# Altium schematic sheet Sch5PowerControlCenter.SchDoc: Power Control Center (PCC)
size A3; Address1: Afshin Kashani Ilkhechi; DocumentNumber: 5; Revision: 2; SheetNumber: 5; SheetTotal: 5
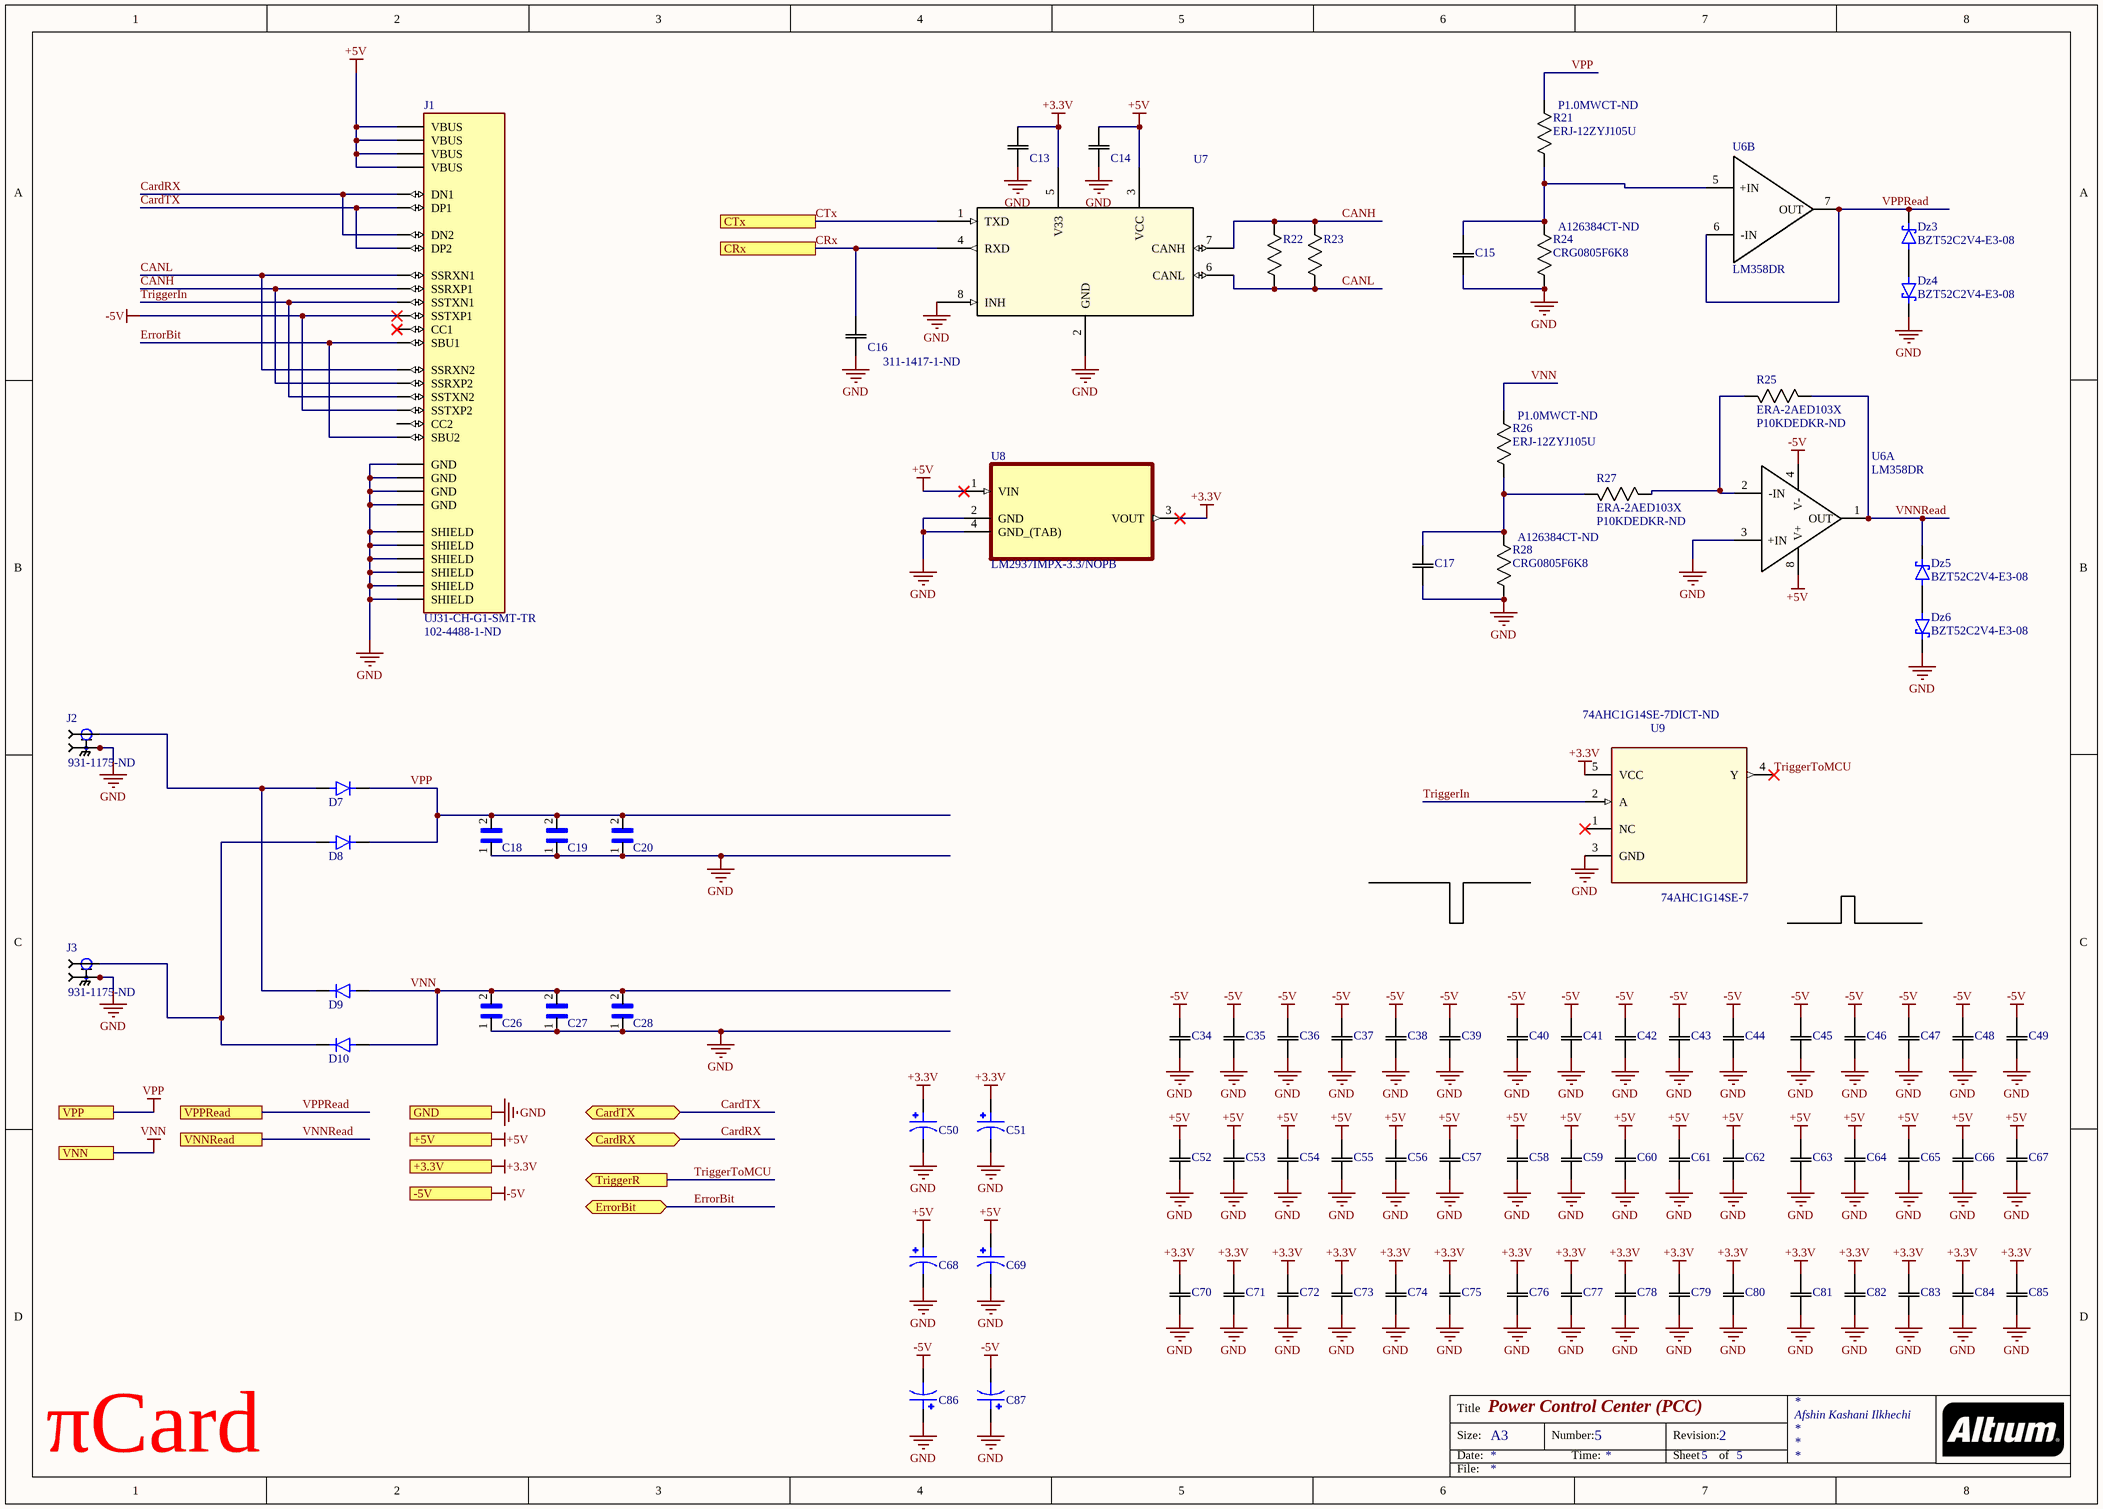
[diagram p0: Sch5PowerControlCenter.SchDoc]

## Parts
C13  GRM155R71C103MA01D  [C0402]  (value not drawn)
C14  GRM155R71C103MA01D  [C0402]  (value not drawn)
C15  C0805C104Z5VACTU  [C0805]  (value not drawn)
C16  Supplier Part Number 1: 311-1417-1-ND  [C0402]  (hidden comment: CC0402JRNPO9BN200)
C17  C0805C104Z5VACTU  [C0805]  (value not drawn)
C18  2220Y5000105KXTWS2  [CAPC5750X450N]  (value not drawn)
C19  2220Y5000105KXTWS2  [CAPC5750X450N]  (value not drawn)
C20  2220Y5000105KXTWS2  [CAPC5750X450N]  (value not drawn)
C26  2220Y5000105KXTWS2  [CAPC5750X450N]  (value not drawn)
C27  2220Y5000105KXTWS2  [CAPC5750X450N]  (value not drawn)
C28  2220Y5000105KXTWS2  [CAPC5750X450N]  (value not drawn)
C34  GRM155R71C103MA01D  [C0402]  (value not drawn)
C35  GRM155R71C103MA01D  [C0402]  (value not drawn)
C36  GRM155R71C103MA01D  [C0402]  (value not drawn)
C37  GRM155R71C103MA01D  [C0402]  (value not drawn)
C38  GRM155R71C103MA01D  [C0402]  (value not drawn)
C39  GRM155R71C103MA01D  [C0402]  (value not drawn)
C40  C0805C104Z5VACTU  [C0805]  (value not drawn)
C41  C0805C104Z5VACTU  [C0805]  (value not drawn)
C42  C0805C104Z5VACTU  [C0805]  (value not drawn)
C43  C0805C104Z5VACTU  [C0805]  (value not drawn)
C44  C0805C104Z5VACTU  [C0805]  (value not drawn)
C45  GRM155R71H102KA01J  [C0402]  (value not drawn)
C46  GRM155R71H102KA01J  [C0402]  (value not drawn)
C47  GRM155R71H102KA01J  [C0402]  (value not drawn)
C48  GRM155R71H102KA01J  [C0402]  (value not drawn)
C49  GRM155R71H102KA01J  [C0402]  (value not drawn)
C50  T55A107M6R3C0200  [C1206]  (value not drawn)
C51  T55A107M6R3C0200  [C1206]  (value not drawn)
C52  GRM155R71C103MA01D  [C0402]  (value not drawn)
C53  GRM155R71C103MA01D  [C0402]  (value not drawn)
C54  GRM155R71C103MA01D  [C0402]  (value not drawn)
C55  GRM155R71C103MA01D  [C0402]  (value not drawn)
C56  GRM155R71C103MA01D  [C0402]  (value not drawn)
C57  GRM155R71C103MA01D  [C0402]  (value not drawn)
C58  C0805C104Z5VACTU  [C0805]  (value not drawn)
C59  C0805C104Z5VACTU  [C0805]  (value not drawn)
C60  C0805C104Z5VACTU  [C0805]  (value not drawn)
C61  C0805C104Z5VACTU  [C0805]  (value not drawn)
C62  C0805C104Z5VACTU  [C0805]  (value not drawn)
C63  GRM155R71H102KA01J  [C0402]  (value not drawn)
C64  GRM155R71H102KA01J  [C0402]  (value not drawn)
C65  GRM155R71H102KA01J  [C0402]  (value not drawn)
C66  GRM155R71H102KA01J  [C0402]  (value not drawn)
C67  GRM155R71H102KA01J  [C0402]  (value not drawn)
C68  T55A107M6R3C0200  [C1206]  (value not drawn)
C69  T55A107M6R3C0200  [C1206]  (value not drawn)
C70  GRM155R71C103MA01D  [C0402]  (value not drawn)
C71  GRM155R71C103MA01D  [C0402]  (value not drawn)
C72  GRM155R71C103MA01D  [C0402]  (value not drawn)
C73  GRM155R71C103MA01D  [C0402]  (value not drawn)
C74  GRM155R71C103MA01D  [C0402]  (value not drawn)
C75  GRM155R71C103MA01D  [C0402]  (value not drawn)
C76  C0805C104Z5VACTU  [C0805]  (value not drawn)
C77  C0805C104Z5VACTU  [C0805]  (value not drawn)
C78  C0805C104Z5VACTU  [C0805]  (value not drawn)
C79  C0805C104Z5VACTU  [C0805]  (value not drawn)
C80  C0805C104Z5VACTU  [C0805]  (value not drawn)
C81  GRM155R71H102KA01J  [C0402]  (value not drawn)
C82  GRM155R71H102KA01J  [C0402]  (value not drawn)
C83  GRM155R71H102KA01J  [C0402]  (value not drawn)
C84  GRM155R71H102KA01J  [C0402]  (value not drawn)
C85  GRM155R71H102KA01J  [C0402]  (value not drawn)
C86  T55A107M6R3C0200  [C1206]  (value not drawn)
C87  T55A107M6R3C0200  [C1206]  (value not drawn)
D7  CD1408-R11000  [CD1408]  (value not drawn)
D8  CD1408-R11000  [CD1408]  (value not drawn)
D9  CD1408-R11000  [CD1408]  (value not drawn)
D10  CD1408-R11000  [CD1408]  (value not drawn)
Dz3  BZT52C2V4-E3-08  [SOD-123]
Dz4  BZT52C2V4-E3-08  [SOD-123]
Dz5  BZT52C2V4-E3-08  [SOD-123]
Dz6  BZT52C2V4-E3-08  [SOD-123]
J1  UJ31-CH-G1-SMT-TR  Supplier Part Number 1: 102-4488-1-ND  [CUI_UJ31-CH-G1-SMT-TR]
J2  Supplier Part Number 1: 931-1175-ND  [*TAOGLAS_EMPCB.SMAFSTJ.B.HT_EMPCB.SMAFSTJ.B.HT(Primary)]  (hidden comment: EMPCB.SMAFSTJ.B.HT)
J3  Supplier Part Number 1: 931-1175-ND  [*TAOGLAS_EMPCB.SMAFSTJ.B.HT_EMPCB.SMAFSTJ.B.HT(Primary)]  (hidden comment: EMPCB.SMAFSTJ.B.HT)
R21  ERJ-12ZYJ105U  Supplier Part Number 1: P1.0MWCT-ND  [R2010]
R22  CRGCQ0805F120R  [0805]  (value not drawn)
R23  CRGCQ0805F120R  [0805]  (value not drawn)
R24  CRG0805F6K8  Supplier Part Number 1: A126384CT-ND  [0805]
R25  ERA-2AED103X  Supplier Part Number 1: P10KDEDKR-ND  [R0402]
R26  ERJ-12ZYJ105U  Supplier Part Number 1: P1.0MWCT-ND  [R2010]
R27  ERA-2AED103X  Supplier Part Number 1: P10KDEDKR-ND  [R0402]
R28  CRG0805F6K8  Supplier Part Number 1: A126384CT-ND  [0805]
U6  LM358DR  [SOIC127P600X175-8N]  (parts A,B of 2)
U7  IFX1050GVIOXUMA1  [SOIC127P600X175-8N]  (value not drawn)
U8  LM2937IMPX-3.3/NOPB  [SOT230P700X180-4N]
U9  74AHC1G14SE-7  Supplier Part Number 1: 74AHC1G14SE-7DICT-ND  [*SOT65P210X110-5N]

## Ports
+3.3V, +5V, -5V, CardRX (bidir), CardTX (bidir), CRx, CTx, ErrorBit (bidir), GND, TriggerR (out), VNN, VNNRead, VPP, VPPRead

## Nets
+3.3V: C13.2 C50.1(POS) C51.1(POS) C70.2 C71.2 C72.2 C73.2 C74.2 C75.2 C76.2 C77.2 C78.2 C79.2 C80.2 C81.2 C82.2 C83.2 C84.2 C85.2 U7.5(V33) U8.3(VOUT) U9.5(VCC) ; port +3.3V
+5V: C14.2 C52.2 C53.2 C54.2 C55.2 C56.2 C57.2 C58.2 C59.2 C60.2 C61.2 C62.2 C63.2 C64.2 C65.2 C66.2 C67.2 C68.1(POS) C69.1(POS) J1.A4(VBUS) J1.A9(VBUS) J1.B4(VBUS) J1.B9(VBUS) U6.8(V+) U7.3(VCC) U8.1(VIN) ; port +5V
-5V: C34.2 C35.2 C36.2 C37.2 C38.2 C39.2 C40.2 C41.2 C42.2 C43.2 C44.2 C45.2 C46.2 C47.2 C48.2 C49.2 C86.2(NEG) C87.2(NEG) J1.A2(SSTXP1) J1.B2(SSTXP2) U6.4(V-) ; port -5V
GND: C13.1 C14.1 C15.1 C16.1 C17.1 C18.1 C19.1 C20.1 C26.1 C27.1 C28.1 C34.1 C35.1 C36.1 C37.1 C38.1 C39.1 C40.1 C41.1 C42.1 C43.1 C44.1 C45.1 C46.1 C47.1 C48.1 C49.1 C50.2(NEG) C51.2(NEG) C52.1 C53.1 C54.1 C55.1 C56.1 C57.1 C58.1 C59.1 C60.1 C61.1 C62.1 C63.1 C64.1 C65.1 C66.1 C67.1 C68.2(NEG) C69.2(NEG) C70.1 C71.1 C72.1 C73.1 C74.1 C75.1 C76.1 C77.1 C78.1 C79.1 C80.1 C81.1 C82.1 C83.1 C84.1 C85.1 C86.1(POS) C87.1(POS) Dz4.1(K) Dz6.1(K) J1.A1(GND) J1.A12(GND) J1.B1(GND) J1.B12(GND) J1.SH1(SHIELD) J1.SH2(SHIELD) J1.SH3(SHIELD) J1.SH4(SHIELD) J1.SH5(SHIELD) J1.SH6(SHIELD) J2.SH1 J2.SH2 J2.SH3 J2.SH4 J3.SH1 J3.SH2 J3.SH3 J3.SH4 R24.1 R28.1 U6.3(+IN) U7.2(GND) U7.8(INH) U8.2(GND) U8.4(GND_(TAB)) U9.3(GND) ; port GND
VNN: C26.2 C27.2 C28.2 D9.2 D10.2 R26.2 ; port VNN
VPP: C18.2 C19.2 C20.2 D7.1 D8.1 R21.2 ; port VPP
CANH: J1.A11(SSRXP2) J1.B11(SSRXP1) R22.2 R23.2 U7.7(CANH)
CANL: J1.A10(SSRXN2) J1.B10(SSRXN1) R22.1 R23.1 U7.6(CANL)
CardRX: J1.A7(DN1) J1.B7(DN2) ; port CardRX
CardTX: J1.A6(DP1) J1.B6(DP2) ; port CardTX
CRx: C16.2 U7.4(RXD) ; port CRx
CTx: U7.1(TXD) ; port CTx
ErrorBit: J1.A8(SBU1) J1.B8(SBU2) ; port ErrorBit
TriggerIn: J1.A3(SSTXN1) J1.B3(SSTXN2) U9.2(A)
TriggerToMCU: U9.4(Y) ; port TriggerR
VNNRead: Dz5.1(K) R25.2 U6.1(OUT) ; port VNNRead
VPPRead: Dz3.1(K) U6.6(-IN) U6.7(OUT) ; port VPPRead
NetC15_2: C15.2 R21.1 R24.2 U6.5(+IN)
NetC17_2: C17.2 R26.1 R27.1 R28.2
NetD7_2: D7.2 D9.1 J2.1
NetD8_2: D8.2 D10.1 J3.1
NetDz3_2: Dz3.2(A) Dz4.2(A)
NetDz5_2: Dz5.2(A) Dz6.2(A)
NetR25_1: R25.1 R27.2 U6.2(-IN)

Not connected (* = marked no-connect by the designer): J1 A5(CC1)* B5(CC2); U9 1(NC)*

## Notes on the sheet
- πCard
- Title
- Size:
- Date:
- A3
- Number:
- Time:
- Revision:
- Sheet
- of
- File:

## Library data of the parts
C13 C14 C16 C34-C39 C45-C49 C52-C57 C63-C67 C70-C75 C81-C85 = Cap_0402: Supplier 1: Digi-Key
  C13 C14 C34-C39 C52-C57 C70-C75: Supplier Part Number 1: 490-16353-1-ND
  C45-C49 C63-C67 C81-C85: Supplier Part Number 1: 490-6350-1-ND
C15 C17 C40-C44 C58-C62 C76-C80 = Cap_0805: Supplier 1: Digi-Key; Supplier Part Number 1: 399-1177-1-ND
C18-C20 C26-C28 = 2220Y5000105KXTWS2: 1ÂµF Â±10% 500V Ceramic Capacitor X7R 2220 (5750 Metric); MF: Syfer; Price: None; Availability: Unavailable; SnapEDA_Link: https://www.snapeda.com/parts/2220Y5000105KXTWS2/Syfer/view-part/2041581/?ref=snap; Value: *; MP: 2220Y5000105KXTWS2; Package: 5750 Knowles Syfer
C50 C51 C68 C69 C86 C87 = Cap_1206: Tantalium; Supplier 1: Mouser; Supplier Part Number 1: 74-T55A107M6R3C0200
D7-D10 = CD1408-R11000: Diode Standard 1000V 1A Surface Mount 1408; Supplier 1: Digi-Key; Supplier Part Number 1: CD1408-R11000CT-ND
Dz3-Dz6 = BZT52C2V4-E3-08: Zener Diode 2.4V 410mW ±5% Surface Mount SOD-123; Supplier 1: Digi-Key; Supplier Part Number 1: 112-BZT52C2V4-E3-08CT-ND
J1 = UJ31-CH-G1-SMT-TR: Type C, USB 3.1 Gen 2, 5 A, Right Angle, Surface Mount _SMT_ , USB Receptacle; MF: CUI Devices; CUI_purchase_URL: https://www.cuidevices.com/product/interconnect/connectors/usb-connectors/uj31-ch-g1-smt-tr?utm_source=snapeda.com&utm_medium=referral&utm_campaign=snapedaBOM; Price: None; SnapEDA_Link: https://www.snapeda.com/parts/UJ31-CH-G1-SMT-TR/CUI%20Devices/view-part/2754415/?ref=snap; Package: None; Availability: Unavailable; Value: *; MP: UJ31-CH-G1-SMT-TR; Supplier 1: Digi-Key
J2 J3 = EMPCB.SMAFSTJ.B.HT: SMA Connector Jack, Female Socket 50Ohm Board Edge, End Launch Solder; MF: Taoglas Limited; Package: None; Digi-Key_Part_Number: 931-1175-ND; Digi-Key_Purchase_URL: https://www.digikey.com/product-detail/en/taoglas-limited/EMPCB.SMAFSTJ.B.HT/931-1175-ND/3522337?utm_source=snapeda&utm_medium=aggregator&utm_campaign=symbol; MP: EMPCB.SMAFSTJ.B.HT; SnapEDA_Link: https://www.snapeda.com/parts/EMPCB.SMAFSTJ.B.HT/Taoglas%20Limited/view-part/231078/?ref=snap; Value: *; Supplier 1: Digi-Key
R21 R26 = Res_2010: Chip Resistor 2010 (5025 Metric) Automotive AEC-Q200 Thick Film; Supplier 1: Digi-Key
R22-R25 R27 R28 = Res_0805: Supplier 1: Digi-Key
  R22 R23: Supplier Part Number 1: A129738CT-ND
U7 = IFX1050GVIOXUMA1: No Description Available; Vendor: Infineon; Built_By: EMA_UL_Team; SourceLibrary: Infineon_2014-07-30; Manufacturer_Part_Number: IFX1050G; Copyright: Copyright (C) 2018 Accelerated Designs. All rights reserved; RefDes: RefDes; Type: DEV; Supplier 1: Digi-Key; Supplier Part Number 1: IFX1050GVIOXUMA1CT-ND
U8 = LM2937IMPX-3.3/NOPB: Linear Voltage Regulator IC 1 Output 400mA SOT-223-4; MF: Texas Instruments; SnapEDA_Link: https://www.snapeda.com/parts/LM2937IMPX-3.3/NOPB/Texas%20Instruments/view-part/587827/?ref=snap; Package: SOT-223 Texas Instruments; MP: LM2937IMPX-3.3/NOPB; Value: *; Availability: Unavailable; Price: None
U9 = 74AHC1G14SE-7: Inverter IC 1 Channel Schmitt Trigger SOT-353; MF: Diodes Inc.; Package: SOT-353 Diodes Inc.; MP: 74AHC1G14SE-7; Digi-Key_Part_Number: 74AHC1G14SE-7DICT-ND; Digi-Key_Purchase_URL: https://www.digikey.ca/product-detail/en/diodes-incorporated/74AHC1G14SE-7/74AHC1G14SE-7DICT-ND/2639309?utm_source=snapeda&utm_medium=aggregator&utm_campaign=symbol; SnapEDA_Link: https://www.snapeda.com/parts/74AHC1G14SE-7/Diodes%20Inc./view-part/418511/?ref=snap; Value: *; Supplier 1: Digi-Key